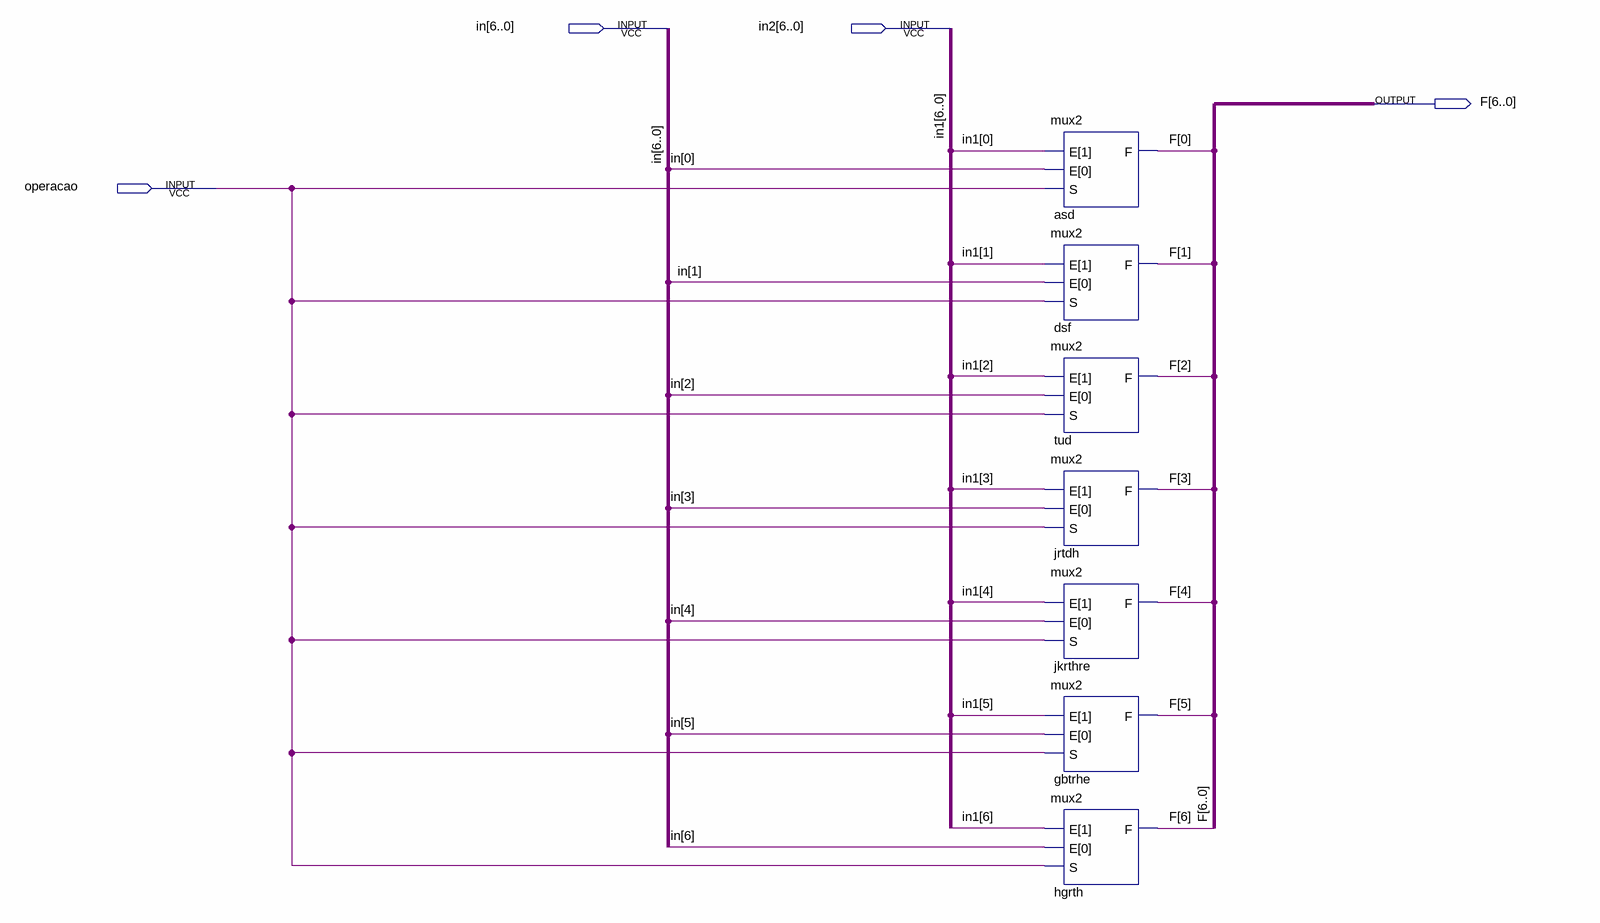
[diagram p0: schematic sheet]
// Quartus schematic muxfinal.bdf as structural Verilog: 7 symbols, 4 pins
module muxfinal (
  input  [6:0] in,
  input  [6:0] in2,
  input  operacao,
  output [6:0] F
);

  mux2 asd (.E({in2[0], in[0]}), .S(operacao), .F(F[0]));
  mux2 dsf (.E({in2[1], in[1]}), .S(operacao), .F(F[1]));
  mux2 tud (.E({in2[2], in[2]}), .S(operacao), .F(F[2]));
  mux2 jrtdh (.E({in2[3], in[3]}), .S(operacao), .F(F[3]));
  mux2 jkrthre (.E({in2[4], in[4]}), .S(operacao), .F(F[4]));
  mux2 gbtrhe (.E({in2[5], in[5]}), .S(operacao), .F(F[5]));
  mux2 hgrth (.E({in2[6], in[6]}), .S(operacao), .F(F[6]));

  // Other names for the same wires on the sheet: in1[6:0] = in2
endmodule
